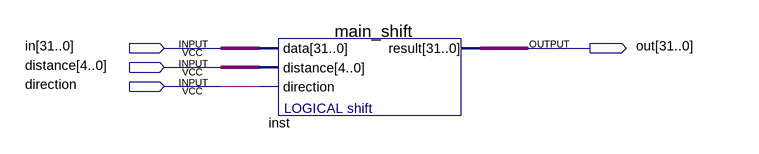
[diagram p0: schematic sheet]
// Quartus schematic shift_right_left_logical.bdf as structural Verilog: 1 symbols, 4 pins
module shift_right_left_logical (
  input  [31:0] in,
  input  [4:0] distance,
  input  direction,
  output [31:0] out
);

  main_shift inst (.data(in), .distance(distance), .direction(direction), .result(out));
endmodule
